# EAGLE design fc power board v3 (EAGLE 8.6.1)
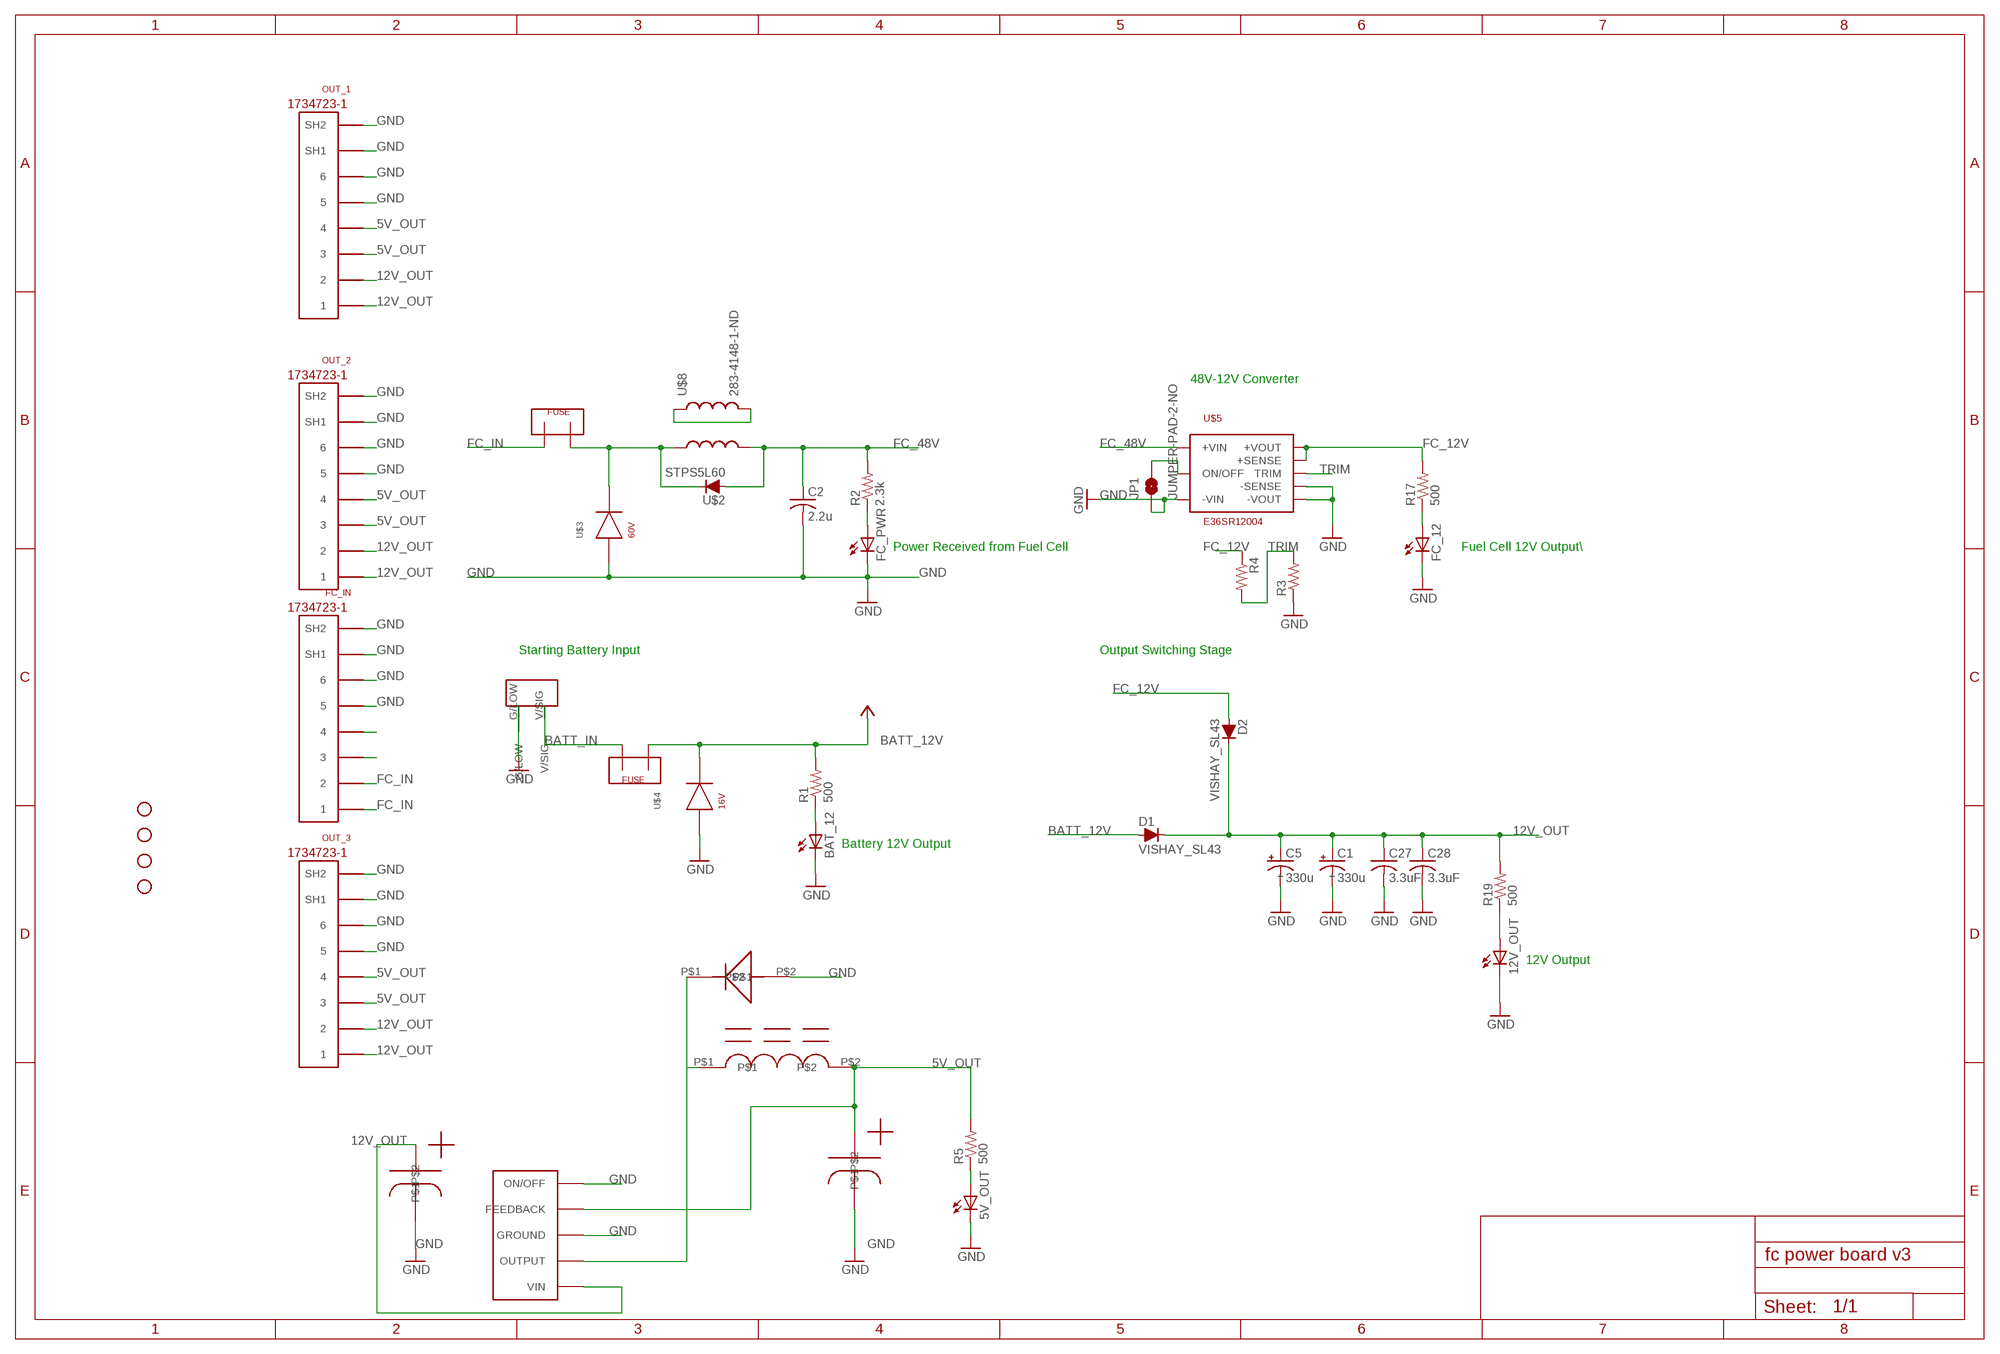
[diagram p0: schematic, sheet 1]

## Parts
5V_OUT  LED1206  [LED-1206]
12V_OUT  LED1206  [LED-1206]
BAT_12  LED1206  [LED-1206]
BATTERY_FUSE  FUSEMINI-BLADE  [MINI-BLADE-FUSE]
C1  330u  399-6608-ND  [399-6608-ND]
C2  2.2u  C-USC0805  [C0805]
C5  330u  399-6608-ND  [399-6608-ND]
C27  3.3uF  C-USC0805  [C0805]
C28  3.3uF  C-USC0805  [C0805]
D1  VISHAY_SL43  [DO-214AB_SMC]
D2  VISHAY_SL43  [DO-214AB_SMC]
FC_12  LED1206  [LED-1206]
FC_IN  5555140-6  [1734723-1_RJ11]
FC_PWR  LED1206  [LED-1206]
JP1  JUMPER-PAD-2-NO  [PAD-JUMPER-2-NO_NO_SILK]
OUT_1  5555140-6  [1734723-1_RJ11]
OUT_2  5555140-6  [1734723-1_RJ11]
OUT_3  5555140-6  [1734723-1_RJ11]
R1  500  R-US_R0805  [R0805]
R2  2.3k  R-US_R0805  [R0805]
R3  R-US_R0805  [R0805]
R4  R-US_R0805  [R0805]
R5  500  R-US_R0805  [R0805]
R17  500  R-US_R0805  [R0805]
R19  500  R-US_M0805  [M0805]
STANDOFF1  STAND-OFF  [STAND-OFF]
STANDOFF2  STAND-OFF  [STAND-OFF]
STANDOFF3  STAND-OFF  [STAND-OFF]
STANDOFF4  STAND-OFF  [STAND-OFF]
U$1  MBR360GOS  [MBR360GOS]
U$2  STPS5L60  [STM_SMC]
U$3  SMBJ60CA  [.277X.089]
U$4  SMAJ16CA  [.25X.07]
U$5  E36SR12004  [2.30X0.90X0.34]
U$7  FUSEMINI-BLADE  [MINI-BLADE-FUSE]
U$8  283-4148-1-ND  [283-4148-1-ND]
U$9  2_PIN_TECONNECTOR  [2_PIN_CONNECT]
U$13  LM2576  [D2PAK-5]
U$14  CAPESK107M025AC3AA  [ESK107M025AC3AA]
U$15  CAPESK108M025AH4EA  [ESK108M025AH4EA]
U$16  M1418-ND  [M1418-ND]

## Nets
5V_OUT: OUT_1.3 OUT_1.4 OUT_2.3 OUT_2.4 OUT_3.3 OUT_3.4 R5.2 U$13.4(FEEDBACK) U$15.P$1 U$16.P$2
12V_OUT: C1.PLUS(+) C5.PLUS(+) C27.1 C28.1 D1.C D2.C OUT_1.1 OUT_1.2 OUT_2.1 OUT_2.2 OUT_3.1 OUT_3.2 R19.2 U$13.1(VIN) U$14.P$1
BATT_12V: BATTERY_FUSE.OUT D1.A R1.2 U$4.CATHODE ; supply symbol labelled +5V
BATT_IN: BATTERY_FUSE.IN U$9.V/SIG
FC_12V: D2.A R4.1 R17.2 U$5.P$7(+SENSE) U$5.P$8(+VOUT)
FC_48V: C2.1 R2.2 U$2.A U$5.P$1(+VIN) U$8.P$3
FC_FUSED: U$2.C U$3.CATHODE U$7.IN U$8.P$1
FC_IN: FC_IN.1 FC_IN.2 U$7.OUT
GND: 5V_OUT.C 12V_OUT.C BAT_12.C C1.MINUS(-) C2.2 C5.MINUS(-) C27.2 C28.2 FC_12.C FC_IN.5 FC_IN.6 FC_IN.SH1 FC_IN.SH2 FC_PWR.C JP1.1 OUT_1.5 OUT_1.6 OUT_1.SH1 OUT_1.SH2 OUT_2.5 OUT_2.6 OUT_2.SH1 OUT_2.SH2 OUT_3.5 OUT_3.6 OUT_3.SH1 OUT_3.SH2 R3.1 U$1.P$2 U$3.ANODE U$4.ANODE U$5.P$3(-VIN) U$5.P$4(-VOUT) U$5.P$5(-SENSE) U$9.G/LOW U$13.3(GROUND) U$13.5(ON/OFF) U$13.GROUND U$14.P$2 U$15.P$2
N$1: JP1.2 U$5.P$2(ON/OFF)
N$3: BAT_12.A R1.1
N$4: FC_PWR.A R2.1
N$5: U$8.P$2 U$8.P$4
N$6: 5V_OUT.A R5.1
N$7: U$1.P$1 U$13.2(OUTPUT) U$16.P$1
N$20: FC_IN.4
N$21: FC_12.A R17.1
N$23: FC_IN.3
N$24: 12V_OUT.A R19.1
TRIM: R3.2 R4.2 U$5.P$6(TRIM)

## Notes on the sheet
- 48V-12V Converter
- Power Received from Fuel Cell | Fuel Cell 12V Output\
- Starting Battery Input | Output Switching Stage
- Battery 12V Output
- 12V Output

## Library data of the parts
5V_OUT 12V_OUT BAT_12 FC_12 FC_PWR = SparkFun:LED: LEDs Standard schematic elements and footprints for 5mm, 3mm, 1206, and 0603 sized LEDs. 5mm - Spark Fun Electronics SKU : COM-00529 (and others)
BATTERY_FUSE U$7 = Shell2013:FUSE
C1 C5 = 399-6608-ND:399-6608-ND: 330 uF capacitor
C2 C27 C28 = resistor:C-US: CAPACITOR, American symbol
D1 D2 = Power Board Components:VISHAY_SL43
FC_IN OUT_1-OUT_3 = 5555140-6 RJ11:5555140-6
JP1 = SparkFun-Passives:JUMPER-PAD-2-NO
R1-R5 R17 = resistor:R-US_: RESISTOR, American symbol
R19 = rcl:R-US_: RESISTOR, American symbol
STANDOFF1-STANDOFF4 = SparkFun-Electromechanical:STAND-OFF: #4 Stand Off This is the mechanical footprint for a #4 phillips button head screw. Use the keepout ring to avoid running the screw head into surrounding components. SKU : PRT-00447
U$1 = Shell2013:MBR360GOS
U$2 = Power Board Components:STPS5L60
U$3 = Power Board Components:SMBJ60CA
U$4 = Power Board Components:SMAJ16CA
U$5 = Power Board Components:E36SR12004
U$8 = 283-4148-1-ND:283-4148-1-ND
U$9 = TE 2-pin connector:2_PIN_TECONNECTOR: 2-pin connector for high power connections on board
U$13 = Shell2015:LM2576
U$14 U$15 = Shell2015:CAP
U$16 = Shell2015:M1418-ND: 100uF inductor

## Board
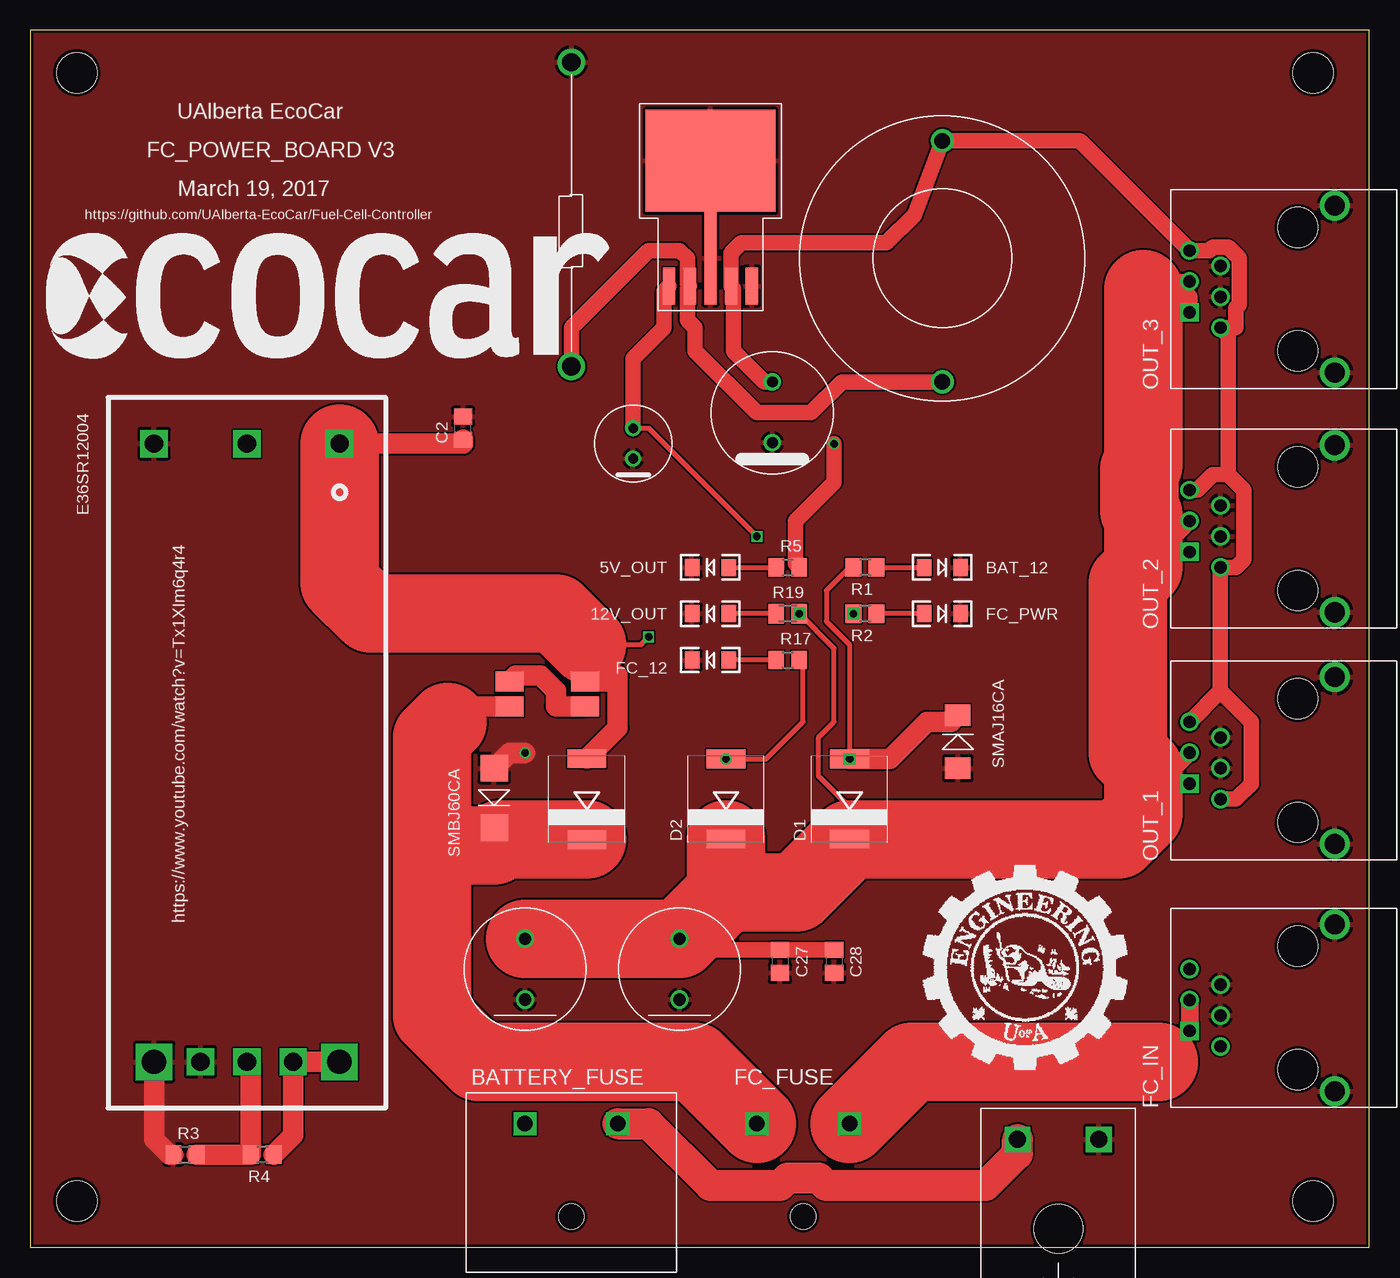
[diagram p1: board, top side]
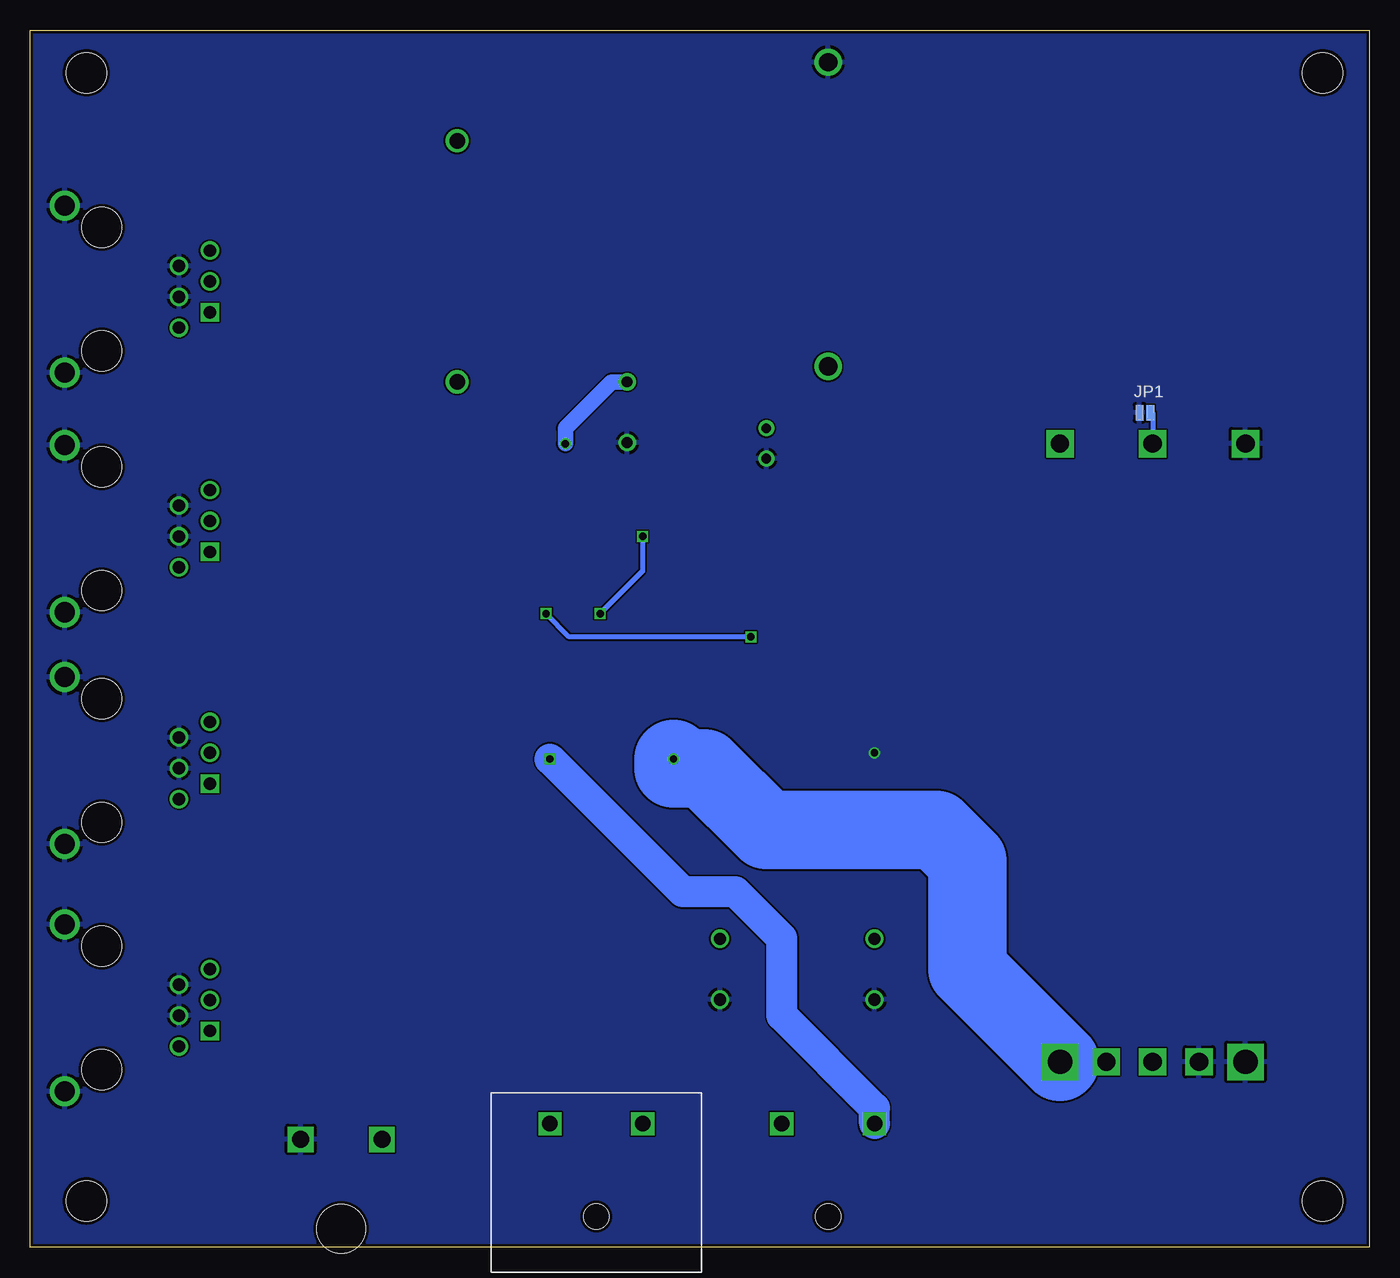
[diagram p2: board, bottom side, seen from below]

Size 110 x 100 mm. Coordinates in mm from the lower left corner, seen from the top.
Outline: 0,0 110,0 110,100 0,100 0,0
Copper layers (1*16): Top 0.035mm / dielectric 1.5mm / Bottom 0.035mm
Design rules "SeeedStudio_2layer_DRU_no_angle_20140221": minimum track width 6mil, minimum drill 12mil, track to track 6mil, track to pad 6mil, pad to pad 6mil, via to via 6mil, smd to smd 0mil, copper to edge 10mil, drill to drill 10mil, minimum pad ring 10mil, minimum via ring 6mil, stop-mask expansion 2mil, vias tented up to drill 100mil, thermal gap 10mil

### Footprints (pad centres in the part's own frame; a part is rotated, then mirrored left to right if it is on the bottom)
LED-1206 = smd 1.2 x 1.4: A -1.5,0; C 1.5,0
MINI-BLADE-FUSE = drill 1.27 square: IN 3.81,7.62; OUT -3.81,7.62 | hole 2.083: 0,0
399-6608-ND = drill 1: MINUS 0,-2.5; PLUS 0,2.5
C0805 = smd 1.3 x 1.5: 1 -0.95,0; 2 0.95,0
DO-214AB_SMC = smd 1.524 x 3.2: A 3.302,0; C -3.302,0
1734723-1_RJ11 = drill 1 square: 1 -2.54,2.54 | drill 1: 2 0,2.54; 3 2.54,2.54; 4 -3.81,0; 5 -1.27,0; 6 1.27,0 | drill 1.65: SH1 -7.5,-9.4; SH2 6.22,-9.4 | hole 3.3: -5.72,-6.35; 4.44,-6.35
PAD-JUMPER-2-NO_NO_SILK = smd 0.635 x 1.27: 1 -0.45,0; 2 0.45,0
R0805 = smd 1.3 x 1.5: 1 -0.95,0; 2 0.95,0
M0805 = smd 1.3 x 1.6: 1 -0.95,0; 2 0.95,0
STAND-OFF = hole 3.302: 0,0
MBR360GOS = drill 1.5: P$1 0,0; P$2 25,0
STM_SMC = smd 1.54 x 3.14: A 3.325,0; C -3.325,0
.277X.089 = smd 2.159 x 2.261: ANODE 0,0; CATHODE 4.877,0
.25X.07 = smd 1.778 x 2.083: ANODE 0,0; CATHODE 4.369,0
2.30X0.90X0.34 = drill 1.5 square: P$1 -25.4,7.62; P$2 -25.4,0; P$3 -25.4,-7.62; P$5 25.4,-3.81; P$6 25.4,0; P$7 25.4,3.81 | drill 2 square: P$4 25.4,-7.62; P$8 25.4,7.62
283-4148-1-ND = smd 2.3 x 1.65: P$1 0,0; P$2 6.2,0; P$3 6.2,2.05; P$4 0,2.05
2_PIN_CONNECT = drill 1.4 square: G/LOW 3.34,12.67; V/SIG -3.34,12.67 | hole 4: 0,5.33
D2PAK-5 = smd 3.048 x 1.016: 1 6.096,-3.404; 2 6.096,-1.702; 4 6.096,1.702; 5 6.096,3.404 | smd 7.62 x 1.016: 3 3.81,0 | smd 8.382 x 10.668: GROUND -4.191,0
ESK107M025AC3AA = drill 0.8: P$1 0,0; P$2 2.5,0
ESK108M025AH4EA = drill 0.9: P$1 0,0; P$2 5,0
M1418-ND = drill 1.27: P$1 0,0; P$2 19.812,0

### Placement (x,y rotation side)
5V_OUT  55.88,55.88 180 top
12V_OUT  55.88,52.07 180 top
BAT_12  74.93,55.88 0 top
BATTERY_FUSE  44.45,2.54 0 top
C1  40.64,22.86 0 top
C2  35.56,67.31 90 top
C5  53.34,22.86 0 top
C27  61.59,23.5 270 top
C28  66.04,23.5 270 top
D1  67.31,36.83 90 top
D2  57.15,36.83 90 top
FC_12  55.88,48.26 180 top
FC_IN  97.79,20.32 90 top
FC_PWR  74.93,52.07 0 top
JP1  18.41,68.58 0 bottom
OUT_1  97.79,40.64 90 top
OUT_2  97.79,59.69 90 top
OUT_3  97.79,79.38 90 top
R1  68.58,55.88 180 top
R2  68.58,52.07 180 top
R3  12.7,7.62 0 top
R4  19.05,7.62 180 top
R5  62.23,55.88 0 top
R17  62.23,48.26 0 top
R19  62.23,52.07 0 top
STANDOFF1  3.81,3.81 0 top
STANDOFF2  105.41,3.81 0 top
STANDOFF3  105.41,96.52 0 top
STANDOFF4  3.81,96.52 0 top
U$1  44.45,72.39 90 top
U$2  45.72,36.83 90 top
U$3  38.1,39.37 270 top
U$4  76.2,39.37 90 top
U$5  17.78,40.64 270 top
U$6  [ECOCAR_LOGO_2018]  1.27,73.03 0 top
U$7  63.5,2.54 0 bottom
U$8  39.37,44.45 0 top
U$9  84.45,-3.81 0 top
U$13  55.88,85.09 270 top
U$14  49.53,67.31 270 top
U$15  60.96,71.12 270 top
U$16  74.93,71.12 90 top

### Tracks (layer width: path | path; a pad name or v marks a point on that pad's centre or on a via)
5V_OUT  (via drill 0.6)
  Top 1.27: OUT_2.3 95.89,62.23 97.16,63.5 98.42,63.5 | 98.42,63.5 99.69,62.23 99.69,56.52 99.06,55.88 OUT_2.4 97.79,45.72 | OUT_1.3 97.79,45.72 | OUT_1.4 99.06,36.83 100.33,38.1 100.33,43.18 97.79,45.72 | U$15.P$1 60.33,71.12 57.78,73.66 57.78,78.79 U$13.4 57.58,81.71 58.42,82.55 70.36,82.55 72.64,84.84 U$16.P$2 86.23,90.93 OUT_3.3 96.88,81.92 97.15,82.19 98.43,82.19 99.33,81.28 99.33,77.47 99.06,77.19 99.06,75.56 OUT_3.4 98.42,74.93 98.42,63.5 | v66.04,66.04 66.04,62.87 62.87,59.69 62.87,56.2 R5.2
  Bottom 1.27: U$15.P$1 62.23,71.12 66.04,67.31 v66.04,66.04
12V_OUT  (via drill 0.6)
  Top 0.406: D1.C 67.31,36.2 64.77,38.73 64.77,41.91 66.04,43.18 66.04,49.21 R19.2 | U$14.P$1 50.8,67.31 v59.69,58.42
  Top 1.27: U$14.P$1 49.53,73.03 52.07,75.56 52.07,78.59 U$13.1 | 92.08,56.52 OUT_2.2 | OUT_2.1 93.34,57.15 92.08,58.42 92.08,56.52 | 92.08,56.52 91.44,55.88 | OUT_1.2 93.98,39.37 91.44,39.37 92.08,40.01 92.71,40.01 94.61,38.1 OUT_1.1 | C5.PLUS 54.25,24.45 C27.1 C28.1 | OUT_3.2 93.98,79.38 | 93.98,79.38 95.25,78.11 OUT_3.1 | 91.44,78.74 92.08,79.38 93.98,79.38
  Top 6.452: D2.C 57.15,29.17 | 57.15,29.17 C5.PLUS C1.PLUS | 57.15,29.17 62.95,29.17 D1.C 89.41,33.53 91.44,35.56 91.44,39.37 90.17,40.64 90.17,54.61 91.44,55.88 91.44,60.2 91.12,60.52 91.12,63.94 91.44,64.26 91.44,78.74
  Bottom 0.406: v59.69,58.42 59.69,55.56 R19.2
  other vias: 63.18,52.07
BATT_12V  (via drill 0.6)
  Top 0.406: R1.2 67.31,55.88 65.41,53.98 65.41,51.44 67.31,49.53 D1.A
  Top 1.676: D1.A 70.61,40.13 73.66,43.18 75.64,43.18 U$4.CATHODE
  Bottom 2.54: BATTERY_FUSE.OUT 40.64,11.43 48.26,19.05 48.26,25.4 52.07,29.21 56.39,29.21 D1.A
  other vias: 67.31,40.13
BATT_IN
  Top 2.54: BATTERY_FUSE.IN 50.8,10.16 55.88,5.08 61.59,5.08 62.23,5.71 64.77,5.71 65.41,5.08 78.51,5.08 81.11,7.68 U$9.V/SIG
FC_12V  (via drill 0.6)
  Top 0.406: D2.A 60.45,40.13 63.5,43.18 63.5,47.94 R17.2
  Top 1.676: R4.1 21.59,9.21 U$5.P$7 U$5.P$8
  Bottom 6.452: U$5.P$8 33.02,22.86 33.02,31.75 35.56,34.29 49.53,34.29 54.61,39.37 57.15,39.37 D2.A
  other vias: 57.15,40.13
FC_48V  (via drill 0.6)
  Top 0.406: 45.72,49.53 50.16,49.53 v50.8,50.16
  Top 1.422: 45.72,49.53 45.57,49.38 U$8.P$3
  Top 1.676: 45.72,49.53 45.72,46.65 U$8.P$3 47.77,46.5 48.26,46.99 48.26,42.7 U$2.A | U$5.P$1 35.56,66.04 C2.1
  Top 6.452: U$5.P$1 25.4,54.61 27.94,52.07 43.18,52.07 45.72,49.53
  Bottom 0.406: v50.8,50.16 65.72,50.16 R2.2
  other vias: 67.63,52.07
FC_FUSED
  Top 1.422: U$3.CATHODE 38.1,33.02
  Top 1.676: U$8.P$1 35.56,44.45 34.29,43.18
  Top 6.452: U$7.IN 54.61,15.24 36.83,15.24 33.02,19.05 33.02,31.75 | 33.02,31.75 34.29,33.02 38.1,33.02 38.59,33.51 U$2.C | 34.29,43.18 33.02,41.91 33.02,31.75
FC_IN
  Top 1.422: 92.71,15.24 FC_IN.1 FC_IN.2
  Top 6.452: U$7.OUT 72.39,15.24 92.71,15.24
GND  (via drill 0.6)
  Top 1.676: U$3.ANODE 39.37,40.64 v40.64,40.64 | U$5.P$4 10.16,8.89 11.43,7.62 R3.1
  pour Bottom: -2.54,101.6 116.84,101.6 116.84,-2.54 -2.54,-2.54
  pour Top: -2.54,101.6 116.84,101.6 116.84,-2.54 -2.54,-2.54
N$1
  Bottom 0.406: JP1.2 17.78,68.58 U$5.P$2
N$3
  Top 0.406: R1.1 BAT_12.A
N$4
  Top 0.406: FC_PWR.A R2.1
N$5
  Top 1.676: U$8.P$4 39.86,46.99 41.91,46.99 43.18,45.72 43.18,44.45 U$8.P$2
N$6
  Top 0.406: 5V_OUT.A R5.1
N$7
  Top 1.27: U$1.P$1 44.45,75.56 50.8,81.92 53.34,81.92 53.98,81.28 53.98,79.2 U$13.2 53.98,78.79 53.98,76.2 54.61,75.56 54.61,73.66 59.69,68.58 64.14,68.58 66.67,71.12 U$16.P$1
N$21
  Top 0.406: R17.1 FC_12.A
N$24
  Top 0.406: R19.1 12V_OUT.A
TRIM
  Top 1.676: R3.2 R4.2 18.1,14.92 U$5.P$6

### Text on the board
tPlace: UAlberta EcoCar | FC_POWER_BOARD V3 | March 19, 2017 | https://github.com/UAlberta-EcoCar/Fuel-Cell-Controller | https://www.youtube.com/watch?v=Tx1XIm6q4r4 | BATTERY_FUSE | FC_FUSE